# EAGLE design LEMSv2 (EAGLE 7.6.0)
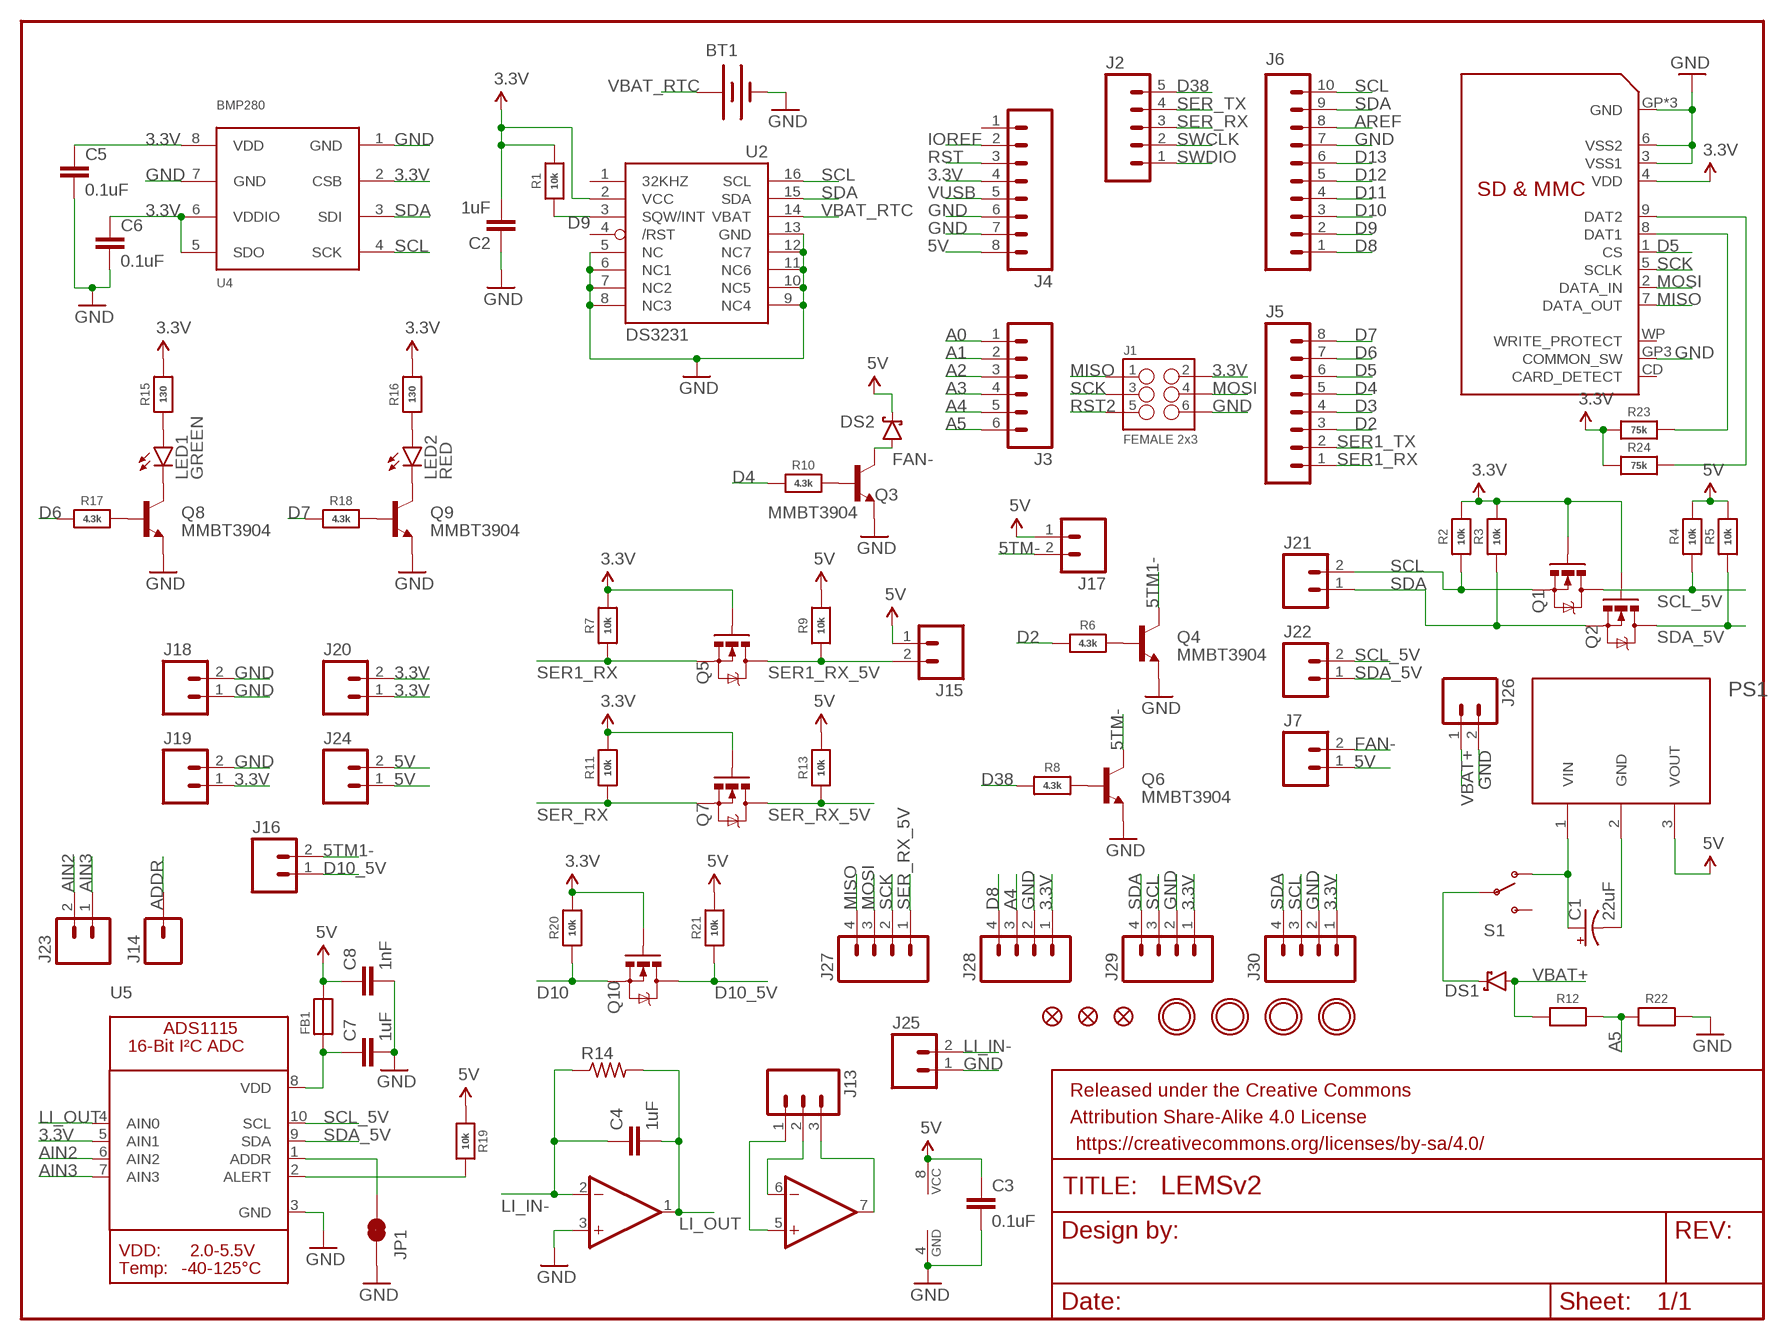
[diagram p0: schematic, sheet 1]

## Parts
BT1  BATTERY12MM  [BATTCON_12MM]
C1  22uF  CAP_POLPTH2  [CPOL-RADIAL-10UF-25V]
C2  1uF  CAP  [_0805]
C3  0.1uF  CAP  [_0805]
C4  1uF  CAP  [_0805]
C5  0.1uF  CAP  [_0805]
C6  0.1uF  CAP  [_0805]
C7  1uF  CAP  [_0805]
C8  1nF  CAP  [_0805]
DS1  DIODE_SCHOTTKY  [DO-214AC]
DS2  DIODE_SCHOTTKY  [DO-214AC]
FB1  FERRITE  [_0805]
FID1  FIDUCIAL""  [FIDUCIAL_1MM]
FID2  FIDUCIAL""  [FIDUCIAL_1MM]
FID3  FIDUCIAL""  [FIDUCIAL_1MM]
FRAME1  FRAME-LETTERNO_PACKAGE  [DUMMY]
J1  FEMALE 2x3  M03X2FEMALE  [2X3]
J2  M05PTH  [1X05]
J3  M06SILK_FEMALE_PTH  [1X06]
J4  M08  [1X08_ROUND]
J5  M08  [1X08_ROUND]
J6  M10SILK_FEMALE_PTH  [1X10]
J7  M023.5MM  [SCREWTERMINAL-3.5MM-2]
J13  M03PTH  [1X03]
J14  M01PTH  [1X01]
J15  M023.5MM  [SCREWTERMINAL-3.5MM-2]
J16  M023.5MM  [SCREWTERMINAL-3.5MM-2]
J17  M023.5MM  [SCREWTERMINAL-3.5MM-2]
J18  M023.5MM  [SCREWTERMINAL-3.5MM-2]
J19  M023.5MM  [SCREWTERMINAL-3.5MM-2]
J20  M023.5MM  [SCREWTERMINAL-3.5MM-2]
J21  M023.5MM  [SCREWTERMINAL-3.5MM-2]
J22  M023.5MM  [SCREWTERMINAL-3.5MM-2]
J23  M023.5MM  [SCREWTERMINAL-3.5MM-2]
J24  M023.5MM  [SCREWTERMINAL-3.5MM-2]
J25  M023.5MM  [SCREWTERMINAL-3.5MM-2]
J26  M023.5MM  [SCREWTERMINAL-3.5MM-2]
J27  M04SCREW  [SCREWTERMINAL-3.5MM-4]
J28  M04SCREW  [SCREWTERMINAL-3.5MM-4]
J29  M04SCREW  [SCREWTERMINAL-3.5MM-4]
J30  M04SCREW  [SCREWTERMINAL-3.5MM-4]
JP1  JUMPER-PAD-2-NC_BY_TRACE  [PAD-JUMPER-2-NC_BY_TRACE_YES_SILK]
LED1  GREEN  LED_GREEN  [LED-0603]
LED2  RED  LED_RED  [LED-0603]
PS1  TSR_1-2450  [TSR_1-2450]
Q1  200mA/50V  MOSFET-NCHANNELBSS138  [SOT23-3]
Q2  200mA/50V  MOSFET-NCHANNELBSS138  [SOT23-3]
Q3  MMBT3904  [SOT23-3]
Q4  MMBT3904  [SOT23-3]
Q5  200mA/50V  MOSFET-NCHANNELBSS138  [SOT23-3]
Q6  MMBT3904  [SOT23-3]
Q7  200mA/50V  MOSFET-NCHANNELBSS138  [SOT23-3]
Q8  MMBT3904  [SOT23-3]
Q9  MMBT3904  [SOT23-3]
Q10  200mA/50V  MOSFET-NCHANNELBSS138  [SOT23-3]
R1  10k  RESISTOR_0805  [_0805]
R2  10k  RESISTOR_0805  [_0805]
R3  10k  RESISTOR_0805  [_0805]
R4  10k  RESISTOR_0805  [_0805]
R5  10k  RESISTOR_0805  [_0805]
R6  4.3k  RESISTOR_0805  [_0805]
R7  10k  RESISTOR_0805  [_0805]
R8  4.3k  RESISTOR_0805  [_0805]
R9  10k  RESISTOR_0805  [_0805]
R10  4.3k  RESISTOR_0805  [_0805]
R11  10k  RESISTOR_0805  [_0805]
R12  RESISTOR_0805  [_0805]
R13  10k  RESISTOR_0805  [_0805]
R14  R-US_FLIPFLOP  [0805-THM]
R15  130  RESISTOR_0805  [_0805]
R16  130  RESISTOR_0805  [_0805]
R17  4.3k  RESISTOR_0805  [_0805]
R18  4.3k  RESISTOR_0805  [_0805]
R19  10k  RESISTOR_0805  [_0805]
R20  10k  RESISTOR_0805  [_0805]
R21  10k  RESISTOR_0805  [_0805]
R22  RESISTOR_0805  [_0805]
R23  75k  RESISTOR_0805  [_0805]
R24  75k  RESISTOR_0805  [_0805]
S1  SWITCH-SPDTPTH  [SWITCH-SPDT]
U1  SDMMC06132  [06132]
U2  DS3231/SO  [SO16W]
U3  TLV2372  [SOIC8]
U4  BMP280  [BMP280]
U5  ADC_ADS1115  [MSOP10]
U$1  MOUNTINGHOLE2.5  [MOUNTINGHOLE_2.5_PLATED]
U$2  MOUNTINGHOLE2.5  [MOUNTINGHOLE_2.5_PLATED]
U$3  MOUNTINGHOLE2.5  [MOUNTINGHOLE_2.5_PLATED]
U$4  MOUNTINGHOLE2.5  [MOUNTINGHOLE_2.5_PLATED]

## Nets
3.3V: C2.2 C5.1 C6.1 J1.2 J4.4 J19.1 J20.1 J20.2 J28.1 J29.1 J30.1 Q1.1(G) Q2.1(G) Q5.1(G) Q7.1(G) Q10.1(G) R1.2 R2.2 R3.2 R7.2 R11.2 R15.2 R16.2 R20.2 R23.1 R24.1 U1.4(VDD) U2.2(VCC) U4.2(CSB) U4.5(SDO) U4.6(VDDIO) U4.8(VDD) U5.5(AIN1)
5TM1-: J16.2 Q4.3(C)
5TM-: J17.2 Q6.3(C)
5V: C3.1 C8.1 DS2.C FB1.2 J4.8 J7.1 J15.1 J17.1 J24.1 J24.2 PS1.3(VOUT) R4.2 R5.2 R9.2 R13.2 R19.1 R21.2 U3.8(TLV2372-PWRN:VCC)
A0: J3.1
A1: J3.2
A2: J3.3
A3: J3.4
A4: J3.5 J28.3
A5: J3.6 R12.2 R22.1
ADDR: J14.1 JP1.1 U5.1(ADDR)
AIN2: J23.2 U5.6(AIN2)
AIN3: J23.1 U5.7(AIN3)
ALERT: R19.2 U5.2(ALERT)
AREF: J6.8
D2: J5.3 R6.1
D3: J5.4
D4: J5.5 R10.1
D5: J5.6 U1.1(CS)
D6: J5.7 R17.1
D7: J5.8 R18.1
D8: J6.1 J28.4
D9: J6.2 R1.1 U2.3(SQW/INT)
D10: J6.3 Q10.2(S) R20.1
D10_5V: J16.1 Q10.3(D) R21.1
D11: J6.4
D12: J6.5
D13: J6.6
D38: J2.5 R8.1
FAN-: DS2.A J7.2 Q3.3(C)
GND: BT1.GND(-) C1.2(-) C2.1 C3.2 C5.2 C6.2 C7.2 C8.2 J1.6 J4.6 J4.7 J6.7 J18.1 J18.2 J19.2 J25.1 J26.2 J28.2 J29.2 J30.2 JP1.2 PS1.2(GND) Q3.2(E) Q4.2(E) Q6.2(E) Q8.2(E) Q9.2(E) R22.2 U1.3(VSS1) U1.6(VSS2) U1.GP2(GND) U1.GP3(COMMON_SW) U1.GP4(GND) U1.GP(GND) U2.5(NC) U2.6(NC1) U2.7(NC2) U2.8(NC3) U2.9(NC4) U2.10(NC5) U2.11(NC6) U2.12(NC7) U2.13(GND) U3.3(TLV2372-1:+IN) U3.4(TLV2372-PWRN:GND) U4.1(GND) U4.7(GND) U5.3(GND)
IOREF: J4.2
LI_IN-: C4.1 J25.2 R14.1 U3.2(TLV2372-1:-IN)
LI_OUT: C4.2 R14.2 U3.1(TLV2372-1:OUT) U5.4(AIN0)
MISO: J1.1 J27.4 U1.7(DATA_OUT)
MOSI: J1.4 J27.3 U1.2(DATA_IN)
N$1: C1.1(+) PS1.1(VIN) S1.1(O)
N$2: J13.2 U3.6(TLV2372-2:-IN)
N$3: J13.1 U3.5(TLV2372-2:+IN)
N$4: J13.3 U3.7(TLV2372-2:OUT)
N$5: Q8.1(B) R17.2
N$6: Q9.1(B) R18.2
N$7: LED1.C Q8.3(C)
N$8: LED2.C Q9.3(C)
N$9: LED1.A R15.1
N$10: LED2.A R16.1
N$11: Q4.1(B) R6.2
N$12: Q6.1(B) R8.2
N$13: DS1.C S1.2(P)
N$14: C7.1 FB1.1 U5.8(VDD)
N$15: Q3.1(B) R10.2
N$17: R23.2 U1.8(DAT1)
N$18: R24.2 U1.9(DAT2)
RST: J4.3
RST2: J1.5
SCK: J1.3 J27.2 U1.5(SCLK)
SCL: J6.10 J21.2 J29.3 J30.3 Q1.2(S) R2.1 U2.16(SCL) U4.4(SCK)
SCL_5V: J22.2 Q1.3(D) R4.1 U5.10(SCL)
SDA: J6.9 J21.1 J29.4 J30.4 Q2.2(S) R3.1 U2.15(SDA) U4.3(SDI)
SDA_5V: J22.1 Q2.3(D) R5.1 U5.9(SDA)
SER1_RX: J5.1 Q5.2(S) R7.1
SER1_RX_5V: J15.2 Q5.3(D) R9.1
SER1_TX: J5.2
SER_RX: J2.3 Q7.2(S) R11.1
SER_RX_5V: J27.1 Q7.3(D) R13.1
SER_TX: J2.4
SWCLK: J2.2
SWDIO: J2.1
VBAT+: DS1.A J26.1 R12.1
VBAT_RTC: BT1.PWR@1(+) U2.14(VBAT)
VUSB: J4.5
Unconnected: J4.1 S1.3(S) U1.CD(CARD_DETECT) U1.WP(WRITE_PROTECT) U2.1(32KHZ) U2.4(/RST)

## Library data of the parts
BT1 = LEMSv2:BATTERY: Battery Holders Various common sizes : AA, AAA, 18650 (PRT-12895), 20mm coin cell and 12mm coin cell. 20MM_4LEGS, BATT-10373; PROD_ID: BATT-08044
C1 = LEMSv2:CAP_POL: Capacitor Polarized These are standard SMD and PTH capacitors. Normally 10uF, 47uF, and 100uF in electrolytic and tantalum varieties. Always verify the external diameter of the through hole cap, it varies with capacity, voltage, and manufacturer. The EIA devices should be standard.
C2-C8 = LEMSv2:CAP: Capacitor Standard 0603 ceramic capacitor, and 0.1" leaded capacitor.
DS1 DS2 = LEMSv2:DIODE_SCHOTTKY
FB1 = LEMSv2:FERRITE: 0805 Ferrite Bead
FID1-FID3 = LEMSv2:FIDUCIAL: Fiducial Alignment Points Various fiducial points for machine vision alignment.; BOM: EXCLUDE
FRAME1 = SparkFun-Aesthetics:FRAME-LETTER: Schematic Frame Standard 8.5x11 US Letter frame; DESIGNER: Nobody; VERSION: v01
J1 = LEMSv2:M03X2: 2x3 .1" header. Shrouded, with keying- CONN-10681 SMT- CONN-11415 Pogo pins- HW-11044; PROD_ID: CONN-11566
J2 = SparkFun-Connectors:M05: Header 5 Standard 5-pin 0.1" header. Use with straight break away headers (SKU : PRT-00116), right angle break away headers (PRT-00553), swiss pins (PRT-00743), machine pins (PRT-00117), and female headers (PRT-00115). Molex polarized connector foot print use with SKU : PRT-08230 with associated crimp pins and housings.
J3 = LEMSv2:M06: Header 6 Standard 6-pin 0.1" header. Use with straight break away headers (SKU : PRT-00116), right angle break away headers (PRT-00553), swiss pins (PRT-00743), machine pins (PRT-00117), and female headers (PRT-00115). Molex polarized connector foot print use with SKU : PRT-08094 with associated crimp pins and housings. NOTES ON THE VARIANTS LOCK and LOCK_LONGPADS... This footprint was designed to help hold the alignment of a through-hole component (i.e. 6-pin header) while soldering it into place. You may notice that each hole has been shifted either up or down by 0.005 of an inch from it's more standard position (which is a perfectly straight line). This slight alteration caused the pins (the squares in the middle) to touch the edges of the holes. Because they are alternating, it causes a "brace" to hold the component in place. 0.005 has proven to be the perfect amount of "off-center" position when using our standard breakaway headers. Although looks a little odd when you look at the bare footprint, once you have a header in there, the alteration is very hard to notice. Also,if you push a header all the way into place, it is covered up entirely on the bottom side. This idea of altering the position of holes to aid alignment will be further integrated into the Sparkfun Library for other footprints. It can help hold any component with 3 or more connection pins.; PROD_ID: CONN-08437
J4 J5 = LEMSv2:M08: Header 8 Standard 8-pin 0.1" header. Use with straight break away headers (SKU : PRT-00116), right angle break away headers (PRT-00553), swiss pins (PRT-00743), machine pins (PRT-00117), and female headers (PRT-00115).; PROD_ID: CONN-08437
J6 = LEMSv2:M10: Header 10 Standard 10-pin 0.1" header. Use with straight break away headers (SKU : PRT-00116), right angle break away headers (PRT-00553), swiss pins (PRT-00743), machine pins (PRT-00117), and female headers (PRT-00115).; PROD_ID: CONN-11563
J7 J15-J26 = LEMSv2:M02: Standard 2-pin 0.1" header. Use with - straight break away headers ( PRT-00116) - right angle break away headers (PRT-00553) - swiss pins (PRT-00743) - machine pins (PRT-00117) - female headers (PRT-00115) Molex polarized connector foot print use with: PRT-08233 with associated crimp pins and housings. 2.54_SCREWTERM for use with PRT-10571. 3.5mm Screw Terminal footprints for PRT-08084 5mm Screw Terminal footprints for use with PRT-08432; PROD_ID: CONN-08399
J13 = LEMSv2:M03: Header 3 Standard 3-pin 0.1" header. Use with straight break away headers (SKU : PRT-00116), right angle break away headers (PRT-00553), swiss pins (PRT-00743), machine pins (PRT-00117), and female headers (PRT-00115). Molex polarized connector foot print use with SKU : PRT-08232 with associated crimp pins and housings.
J14 = SparkFun-Connectors:M01: Header 1 Standard 1-pin 0.1" header. Use with straight break away headers (SKU : PRT-00116), right angle break away headers (PRT-00553), swiss pins (PRT-00743), machine pins (PRT-00117), and female headers (PRT-00115). SMTSO-256-ET is a "flush mount" nut for a 4-40 screw. The older package used to be too tight, and did not allow it to sit properly thru the drill hit. The latest (0.165DIA) fits nice and snug.
J27-J30 = LEMSv2:M04: Header 4 Standard 4-pin 0.1" header. Use with straight break away headers (SKU : PRT-00116), right angle break away headers (PRT-00553), swiss pins (PRT-00743), machine pins (PRT-00117), and female headers (PRT-00115). Molex polarized connector foot print use with SKU : PRT-08231 with associated crimp pins and housings. 1MM SMD Version SKU: PRT-10208; PROD_ID: Combine 2x8399
JP1 = SparkFun-Passives:JUMPER-PAD-2-NC_BY_TRACE
LED1 = LEMSv2:LED_GREEN: Green 0603 LED - Lite-On LTST-C190GKT - https://octopart.com/ltst-c190gkt-lite-on-549821
LED2 = LEMSv2:LED_RED: Green 0603 LED - Lite-On LTST-C190KRKT - https://octopart.com/ltst-c190krkt-lite-on-549893
PS1 = LEMSv2:TSR_1-2450: Traco TSR 1-2450 - DC/DC Step-Down Converter 6.5 - 36VDC input with input capacitor 6.5 - 32VDC input w/out input capacitor 5VDC output
Q1 Q2 = SparkFun-DiscreteSemi:MOSFET-NCHANNEL: Common NMOSFET Parts MFG P/N Store ID Prod ID FDD8780 TRANS-09984 SI7820DN TRANS-11055 FDS6630A IC-08089 2N7002PW TRANS-11151 FQP30N06L COM-10213 TRANS-10060 BSS123LT1G TRANS-08345 BSS138 TRANS-00830 BS170 2N7000; PROD_ID: TRANS-00830
Q3 Q4 Q6 Q8 Q9 = LEMSv2:MMBT3904
Q5 Q7 Q10 = LEMSv2:MOSFET-NCHANNEL: Common NMOSFET Parts MFG P/N Store ID Prod ID FDD8780 TRANS-09984 SI7820DN TRANS-11055 FDS6630A IC-08089 2N7002PW TRANS-11151 FQP30N06L COM-10213 TRANS-10060 BSS123LT1G TRANS-08345 BSS138 TRANS-00830 BS170 2N7000; PROD_ID: TRANS-00830
R1-R13 R15-R24 = LEMSv2:RESISTOR: Resistors For new designs, use the packages preceded by an '_' character since they are more reliable: The following footprints should be used on most boards: _0402 - Standard footprint for regular board layouts _0603 - Standard footprint for regular board layouts _0805 - Standard footprint for regular board layouts _1206 - Standard footprint for regular board layouts For extremely tight-pitch boards where space is at a premium, the following 'micro-pitch' footprints can be used (smaller pads, no silkscreen outline, etc.): _0402MP - Micro-pitch footprint for very dense/compact boards _0603MP - Micro-pitch footprint for very dense/compact boards _0805MP - Micro-pitch footprint for very dense/compact boards _1206MP - Micro-pitch footprint for very dense/compact boards
R14 = adafruit:R-US_: RESISTOR, American symbol
S1 = SparkFun-Electromechanical:SWITCH-SPDT: SPDT Switch Simple slide switch, Spark Fun Electronics SKU : COM-00102 DPDT SMT slide switch, AYZ0202, SWCH-08179; PROD_ID: SWCH-08261
U1 = LEMSv2:SDMMC: SD MMC Card holder 4UCON part #06132 - easy to solder
U2 = LEMSv2:DS3231
U3 = LEMSv2:TLV2372: 2-Channel Single-Supply Rail-to-Rail Op-Amp by TI
U4 = LEMSv2:BMP280: BMP280 - Digital Pressure Sensor Technical Specifications: VCC: 1.2-3.6V Operating Temperature: -40°C to 85°C Full Range: 300-11100 hPa
U5 = LEMSv2:ADC_ADS1115: ADS1115 - 16-bit 4-Channel I2C ADC with Internal PGA VDD: 2.0-5.5V Sampling Rate: 8-860ksps Gain Settings: 2/3, 1, 2, 4, 8, 16
U$1-U$4 = LEMSv2:MOUNTINGHOLE: Mounting Hole For #2 screws (0.086"/2.18mm width, 0.094"/2.4mm hole) use 2.5mm; BOM: EXCLUDE

## Board
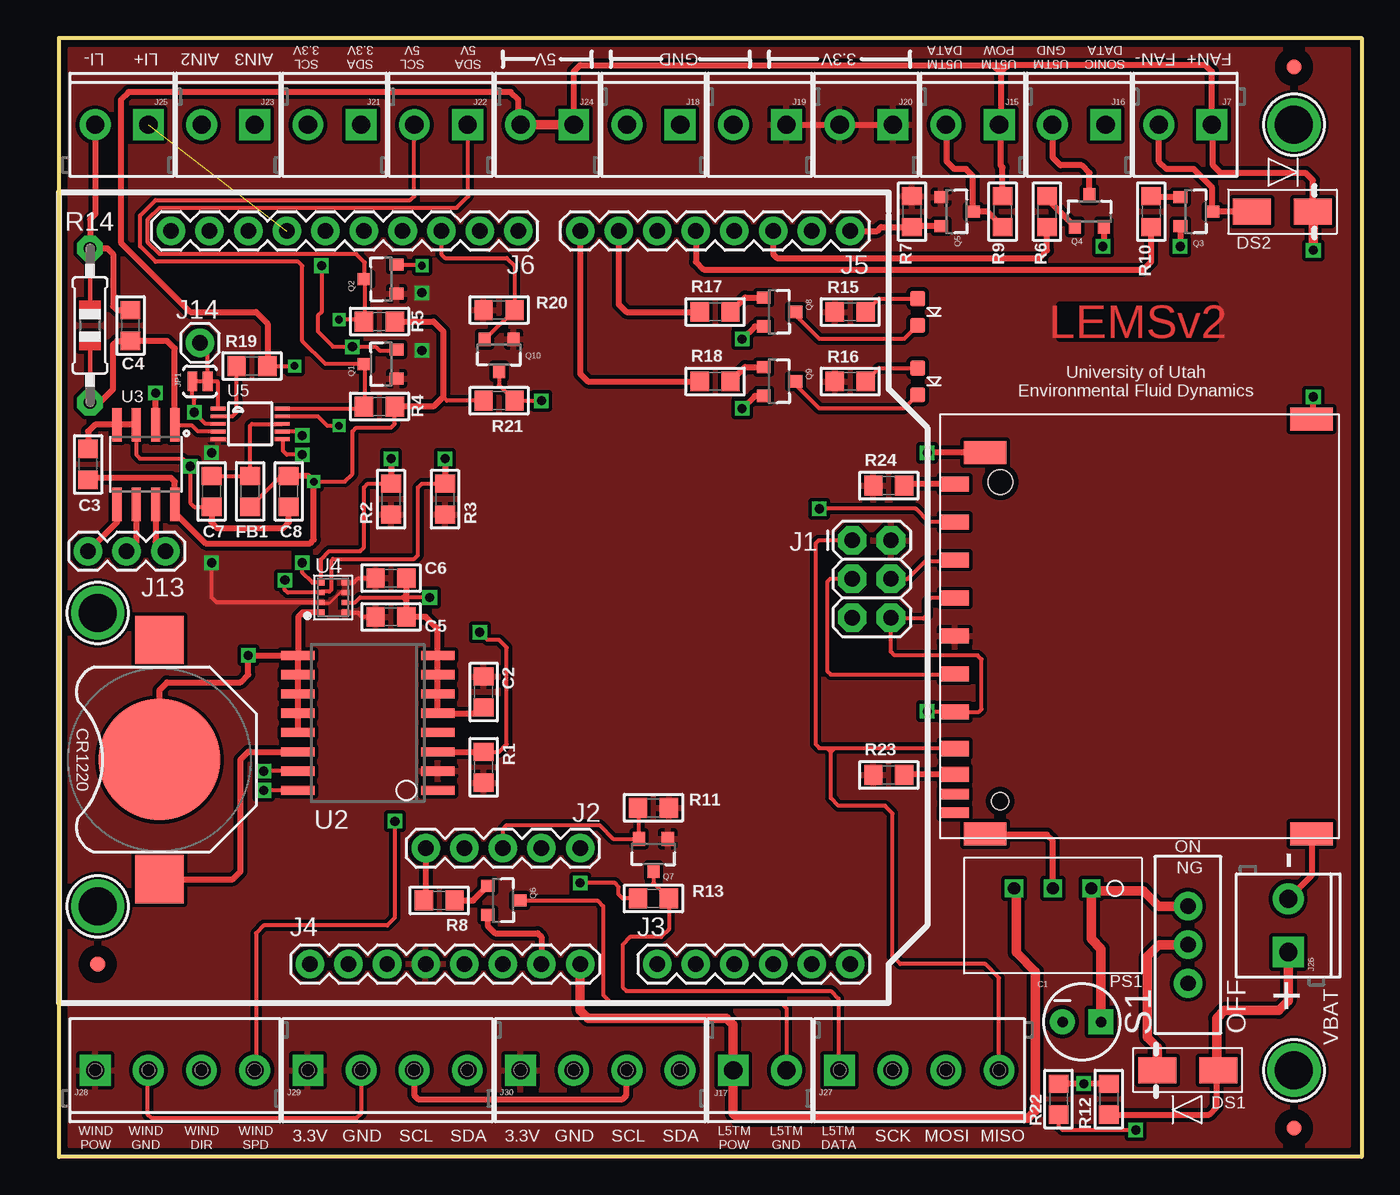
[diagram p1: board, top side]
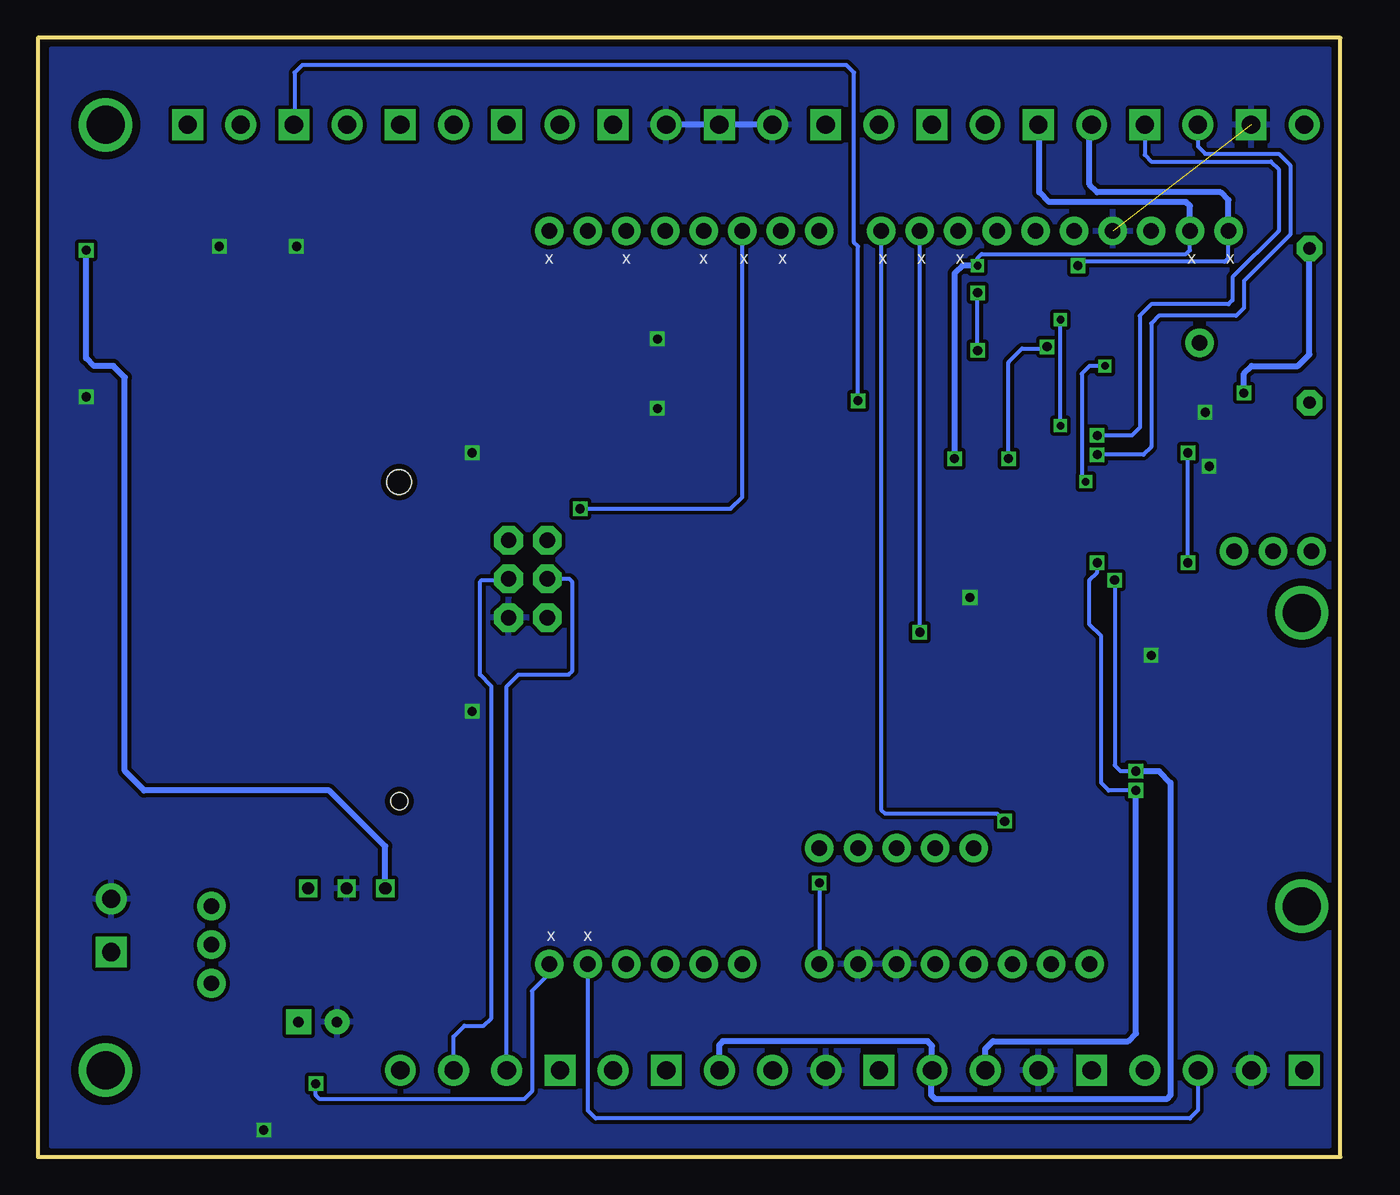
[diagram p2: board, bottom side, seen from below]

Size 85.72 x 73.66 mm. Coordinates in mm from the lower left corner, seen from the top.
Outline: 0,0 0,73.66 85.72,73.66 85.72,0 0,0
Copper layers (1*16): Top 0.0356mm / dielectric 1.5011mm / Bottom 0.0356mm
Design rules "OSHDesignRules": minimum track width 6mil, minimum drill 13mil, track to track 6mil, track to pad 6mil, pad to pad 6mil, via to via 6mil, smd to smd 6mil, copper to edge 15mil, drill to drill 6mil, minimum pad ring 7mil, minimum via ring 7mil, stop-mask expansion 3mil, vias tented up to drill 0mil, thermal gap 10mil

### Footprints (pad centres in the part's own frame; a part is rotated, then mirrored left to right if it is on the bottom)
BATTCON_12MM = smd 8 x 8: GND 0,0 | smd 3.175 x 3.175: PWR@1 -7.874,0; PWR@2 7.874,0
CPOL-RADIAL-10UF-25V = drill 0.7 pad 1.651 square: 1 1.27,0 | drill 0.7 pad 1.651: 2 -1.27,0
_0805 = smd 1.2 x 1.3: 1 -1.016,0; 2 1.016,0
DO-214AC = smd 2.5 x 1.7: A 2,0; C -2,0
FIDUCIAL_1MM = smd 1 x 1: 1 0,0
2X3 = drill 1.016 pad 1.88 octagon: 1 0,0; 2 0,2.54; 3 2.54,0; 4 2.54,2.54; 5 5.08,0; 6 5.08,2.54
1X05 = drill 1.016 pad 1.88: 1 0,0; 2 2.54,0; 3 5.08,0; 4 7.62,0; 5 10.16,0
1X06 = drill 1.016 pad 1.88: 1 0,0; 2 2.54,0; 3 5.08,0; 4 7.62,0; 5 10.16,0; 6 12.7,0
1X08_ROUND = drill 1.016 pad 1.88: 1 0,0; 2 2.54,0; 3 5.08,0; 4 7.62,0; 5 10.16,0; 6 12.7,0; 7 15.24,0; 8 17.78,0
1X10 = drill 1.016 pad 1.88: 1 0,0; 2 2.54,0; 3 5.08,0; 4 7.62,0; 5 10.16,0; 6 12.7,0; 7 15.24,0; 8 17.78,0; 9 20.32,0; 10 22.86,0
SCREWTERMINAL-3.5MM-2 = drill 1.2 pad 2.032 square: 1 -1.75,0 | drill 1.2 pad 2.032: 2 1.75,0
1X03 = drill 1.016 pad 1.88: 1 0,0; 2 2.54,0; 3 5.08,0
1X01 = drill 1.016 pad 1.88: 1 0,0
SCREWTERMINAL-3.5MM-4 = drill 1.2 pad 2.032 square: 1 -5.25,0 | drill 1.2 pad 2.032: 2 -1.75,0; 3 1.75,0; 4 5.25,0
PAD-JUMPER-2-NC_BY_TRACE_YES_SILK = smd 0.635 x 1.27: 1 -0.508,0; 2 0.508,0
LED-0603 = smd 1 x 1: A 0.877,0; C -0.877,0
TSR_1-2450 = drill 0.8 square: 1 -2.54,-1.8; 2 0,-1.8; 3 2.54,-1.8
SOT23-3 = smd 0.8 x 0.9: 1 -0.95,-1; 2 0.95,-1; 3 0,1.1
0805-THM = drill 0.813 pad 1.676 octagon: 1 -5.08,0; 2 5.08,0
SWITCH-SPDT = drill 1.016 pad 1.88: 1 0,2.54; 2 0,0; 3 0,-2.54
06132 = smd 1 x 1.9: 1 6.875,12.175; 2 4.375,12.175; 3 1.875,12.175; 4 -0.625,12.175; 5 -3.125,12.175; 6 -5.625,12.175; 7 -8.05,12.175; 8 -9.75,12.175; 9 9.375,12.175 | smd 0.7 x 1.9: CD -11.05,12.175; WP -12.25,12.175 | smd 1.5 x 2.8: GP -13.65,-11.325; GP2 13.65,-11.325; GP3 11.45,10.175; GP4 -13.65,10.175 | hole 1.1: -11.5,9.175 | hole 1.6: 9.5,9.175
SO16W = smd 0.6 x 2.2: 1 -4.445,-4.6; 2 -3.175,-4.6; 3 -1.905,-4.6; 4 -0.635,-4.6; 5 0.635,-4.6; 6 1.905,-4.6; 7 3.175,-4.6; 8 4.445,-4.6; 9 4.445,4.6; 10 3.175,4.6; 11 1.905,4.6; 12 0.635,4.6; 13 -0.635,4.6; 14 -1.905,4.6; 15 -3.175,4.6; 16 -4.445,4.6
SOIC8 = smd 0.61 x 2.21: 1 -1.905,-2.616; 2 -0.635,-2.616; 3 0.635,-2.616; 4 1.905,-2.616; 5 1.905,2.616; 6 0.635,2.616; 7 -0.635,2.616; 8 -1.905,2.616
BMP280 = smd 0.5 x 0.35: 1 0.8,0.975; 2 0.8,0.325; 3 0.8,-0.325; 4 0.8,-0.975; 5 -0.8,-0.975; 6 -0.8,-0.325; 7 -0.8,0.325; 8 -0.8,0.975
MSOP10 = smd 0.25 x 1: 1 -1,-2.113; 2 -0.5,-2.113; 3 0,-2.113; 4 0.5,-2.113; 5 1,-2.113; 6 1,2.113; 7 0.5,2.113; 8 0,2.113; 9 -0.5,2.113; 10 -1,2.113
MOUNTINGHOLE_2.5_PLATED = drill 2.5 pad 3.2: P$1 0,0

### Placement (x,y rotation side)
BT1  6.6,26.16 90 top
C1  67.31,8.89 0 top
C2  27.94,30.61 90 top
C3  1.91,45.59 90 top
C4  4.7,54.74 270 top
C5  21.84,35.56 0 top
C6  21.84,38.1 0 top
C7  10.03,43.81 270 top
C8  15.11,43.81 270 top
DS1  74.3,5.71 0 top
DS2  80.52,62.23 180 top
FB1  12.57,43.81 270 top
FID1  81.28,1.91 0 top
FID2  2.54,12.7 0 top
FID3  81.28,71.75 0 top
FRAME1  0,0 0 top
J1  52.21,40.59 270 top
J2  34.29,20.32 180 top
J3  39.37,12.7 0 top
J4  16.51,12.7 0 top
J5  52.07,60.96 180 top
J6  30.23,60.96 180 top
J7  74.13,67.94 180 top
J13  1.91,39.88 0 top
J14  9.27,53.59 0 top
J15  60.13,67.94 180 top
J16  67.13,67.94 180 top
J17  46.12,5.71 0 top
J18  39.13,67.94 180 top
J19  46.13,67.94 180 top
J20  53.13,67.94 180 top
J21  18.13,67.94 180 top
J22  25.13,67.94 180 top
J23  11.13,67.94 180 top
J24  32.13,67.94 180 top
J25  4.13,67.94 180 top
J26  80.9,15.24 90 top
J27  56.62,5.71 0 top
J28  7.62,5.71 0 top
J29  21.62,5.71 0 top
J30  35.62,5.71 0 top
JP1  9.27,51.05 180 top
LED1  56.52,55.63 90 top
LED2  56.52,51.05 90 top
PS1  65.41,15.88 180 top
Q1  21.21,52.2 90 top
Q2  21.21,57.78 90 top
Q3  74.8,62.23 270 top
Q4  67.82,62.23 0 top
Q5  59.05,62.23 270 top
Q6  29.21,16.89 270 top
Q7  39.12,19.94 180 top
Q8  47.37,55.63 270 top
Q9  47.37,51.05 270 top
Q10  28.96,52.83 180 top
R1  27.94,25.65 270 top
R2  21.84,43.31 270 top
R3  25.4,43.31 270 top
R4  21.08,49.4 0 top
R5  21.08,54.99 0 top
R6  65.02,62.23 90 top
R7  56.13,62.23 90 top
R8  25.02,16.89 0 top
R9  62.1,62.23 90 top
R10  71.88,62.23 90 top
R11  39.12,22.99 0 top
R12  56k  [_0805]  69.09,3.81 90 top
R13  39.12,17.02 180 top
R14  2.03,54.74 270 top
R15  52.07,55.63 180 top
R16  52.07,51.05 180 top
R17  43.18,55.63 0 top
R18  43.18,51.05 0 top
R19  12.7,52.07 180 top
R20  28.96,55.75 180 top
R21  28.96,49.78 180 top
R22  16k  [_0805]  65.79,3.81 270 top
R23  54.61,25.15 0 top
R24  54.61,44.2 0 top
S1  74.3,13.97 0 top
U1  71.12,34.92 90 top
U2  20.32,28.57 90 top
U3  5.71,45.59 180 top
U4  18.03,36.83 180 top
U5  12.57,48.26 270 top
U$1  81.28,67.94 0 top
U$2  2.54,16.51 0 top
U$3  81.28,5.71 90 top
U$4  2.54,35.81 0 top

### Tracks (layer width: path | path; a pad name or v marks a point on that pad's centre or on a via)
3.3V  (via drill 0.6)
  Top 0.203: U4.6 18.49,37.16 17.78,36.45 17.29,36.45 U4.2
  Top 0.254: C5.1 19.94,35.56 19.68,35.81 18.88,35.81 U4.8 | U4.5 19.39,37.8 19.68,38.1 C6.1 | U4.2 10.36,36.51 10.03,36.83 v10.03,39.12
  Top 0.406: J19.1 J20.2 J20.1
  Bottom 0.254: v23.88,53.09 v23.88,56.9 | v10.03,39.12 v10.03,46.35
  pour Top (isolate 0.254): 0.76,72.9 84.84,72.9 84.84,0.76 0.76,0.76
5TM1-
  Top 0.406: Q4.3 67.82,64.77 67.31,65.28 65.91,65.28 65.41,65.79 65.41,67.92 J16.2
5TM-
  Top 0.254: Q6.3 35.43,16.89 35.81,16.51 35.81,10.67 36.32,10.16 47.5,10.16 47.88,9.78 47.88,5.72 J17.2
5V  (via drill 0.5, 0.6)
  Top 0.254: 14.61,44.83 FB1.2 | R19.1 v15.49,52.07 | v16.76,44.45 18.8,44.45 19.3,44.96 19.3,47.75 19.56,48.01 21.84,48.01 22.1,48.26 R4.2 | R13.2 37.08,17.02 36.83,17.27 36.83,17.78 36.58,18.03 v34.29,18.03 | R21.2 25.53,49.78 25.27,50.04
  Top 0.406: U3.8 7.62,44.45 7.37,44.7 2.03,44.7 C3.1 | 14.61,44.83 C8.1 16.38,44.83 v16.76,44.45 16.76,40.64 16.51,40.39 9.65,40.39 7.62,42.42 | R5.2 24.64,54.99 25.27,54.36 25.27,50.04 24.64,49.4 R4.2 | J24.2 30.23,67.79 30.23,69.6 29.72,70.1 4.57,70.1 4.06,69.6 4.06,60.2 8.64,55.63 12.95,55.63 13.72,54.86 R19.1 | 62.48,71.88 75.44,71.88 75.88,71.44 J7.1 75.95,67.88 75.95,65.28 76.45,64.77 82.04,64.77 82.52,64.29 DS2.C | 62.48,71.88 62.36,71.75 | 62.36,71.75 61.98,71.37 | 61.98,71.37 61.98,68.04 J15.1 61.98,67.85 61.98,65.28 62.1,65.15 R9.2 | J24.1 33.88,71.47 34.29,71.88 61.47,71.88 | 61.72,71.88 62.23,71.88 | 62.23,71.88 62.36,71.75 | 61.98,71.37 61.47,71.88 | 61.47,71.88 61.72,71.88 | 61.72,71.88 61.98,71.63 | 62.23,71.88 62.48,71.88
  Top 0.61: U3.8 7.62,42.42 | J24.2 J24.1 | PS1.3 62.99,17.55 62.99,13.46 64.26,12.19 64.26,3.05 63.75,2.54 44.7,2.54 44.37,2.87 J17.1 44.37,8.72 43.94,9.14 34.8,9.14 34.29,9.65 J4.8 | v82.55,59.69 82.55,62.2 DS2.C
  Bottom 0.254: v15.49,52.07 16.51,52.07 17.02,51.56 17.02,44.7 v16.76,44.45 | v34.29,18.03 J4.8
  Bottom 0.406: PS1.3 62.87,20.45 66.55,24.13 78.74,24.13 80.01,25.4 80.01,51.31 80.77,52.07 82.04,52.07 82.55,52.58 v82.55,59.69
A4
  Bottom 0.254: J28.3 9.37,3.08 9.91,2.54 49.02,2.54 49.53,3.05 J3.5
A5  (via drill 0.6)
  Top 0.406: R12.2 v67.44,4.83 R22.1
  Bottom 0.254: J3.6 52.07,12.06 53.21,10.92 53.21,4.32 53.72,3.81 67.18,3.81 67.44,4.06 v67.44,4.83
ADDR
  Top 0.254: U5.1 10.46,51.01 10.41,51.05 JP1.1 9.78,53.09 J14.1
AIN2  (via drill 0.6)
  Top 0.254: v16,46.23 14.99,46.23 14.73,46.48 14.73,47.21 U5.6
  Bottom 0.254: J23.2 9.38,66.53 8.89,66.04 4.06,66.04 3.3,65.28 3.3,60.71 6.35,57.66 6.35,55.88 6.86,55.37 11.94,55.37 12.45,54.86 12.45,46.74 12.95,46.23 v16,46.23
AIN3  (via drill 0.6)
  Top 0.254: v16,47.5 15.74,47.76 U5.7
  Bottom 0.254: J23.1 12.88,65.96 12.45,65.53 4.57,65.53 4.06,65.02 4.06,60.96 7.11,57.91 7.11,56.39 7.37,56.13 12.45,56.13 13.21,55.37 13.21,48.01 13.72,47.5 v16,47.5
ALERT
  Top 0.254: U5.2 11.42,48.76 11.68,49.02 R19.2
D2
  Top 0.406: J5.3 46.99,59.44 47.24,59.18 64.52,59.18 65.02,59.69 R6.1
D4
  Top 0.406: J5.5 41.91,58.93 42.42,58.42 71.37,58.42 71.88,58.93 R10.1
D5  (via drill 0.6)
  Top 0.254: U1.1 57.26,41.8 56.39,42.67 v50.04,42.67
  Bottom 0.254: v50.04,42.67 40.13,42.67 39.37,43.43 J5.6
D6
  Top 0.406: J5.7 36.83,56.13 37.34,55.63 R17.1
D7
  Top 0.406: J5.8 34.29,51.56 34.8,51.05 R18.1
D8  (via drill 0.6)
  Top 0.254: v22.1,22.1 22.1,15.75 21.59,15.24 13.46,15.24 12.95,14.73 12.95,5.8 J28.4
  Bottom 0.254: J6.1 30.23,22.86 29.97,22.61 22.61,22.61 v22.1,22.1
D9  (via drill 0.6)
  Top 0.254: R1.1 28.96,26.67 29.46,27.18 29.46,33.53 28.96,34.04 28.19,34.04 v27.69,34.54
  Top 0.406: U2.3 R1.1
  Bottom 0.254: v27.69,34.54 J6.2
D10
  Top 0.254: J6.3 25.15,59.44 25.4,59.18 29.46,59.18 29.97,58.67 R20.1 28.05,53.83 Q10.2
D10_5V  (via drill 0.6)
  Top 0.254: Q10.3 28.96,50.8 R21.1 v31.75,49.78
  Bottom 0.254: v31.75,49.78 31.75,59.94 32,60.2 32,71.37 32.51,71.88 68.33,71.88 68.83,71.37 68.83,67.99 J16.1
D38
  Top 0.406: J2.5 24.13,17.02 R8.1
FAN-
  Top 0.406: J7.2 72.39,65.53 72.9,65.02 74.68,65.02 75.9,63.8 Q3.3 DS2.A
GND  (via drill 0.6)  (1 unrouted)
  Top 0.254: U5.3 9.65,48.26 v8.89,49.02 8.89,49.91 8.76,50.04 JP1.2 | U3.3 5.08,46.23 5.33,45.97 8.13,45.97 v8.64,45.47 8.64,43.05 8.89,42.8 C7.2 | U4.7 19.49,36.51 19.81,36.83 22.61,36.83 | 22.61,36.83 22.86,36.58 | v24.38,36.83 22.86,36.83 | J29.2 19.87,2.85 19.56,2.54 6.1,2.54 5.84,2.79 5.84,5.69 J28.2 | R22.2 65.79,2.03 66.04,1.78 v70.87,1.78 | U1.3 57.37,36.8 57.15,36.58 57.15,35.69 56.9,35.43 54.83,35.43 J1.6 54.74,35.5 54.74,33.27 54.99,33.02 60.45,33.02 60.71,32.77 60.71,29.46 60.54,29.3 U1.6 57.19,29.3 v57.15,29.34 | 22.86,37.08 22.61,36.83
  Top 0.406: U2.13 U2.12 U2.11 U2.10 U2.9 | C6.2 22.86,37.08 22.86,36.83 22.86,36.58 C5.2 24.13,35.56 24.92,34.77 U2.8 U2.7 U2.6 U2.5 27.94,29.21 | U4.1 16.04,35.85 15.75,35.56 15.75,33.05 U2.9 | U3.3 U3.4 2.36,48.21 1.91,47.75 C3.2 | C7.2 10.03,41.78 10.41,41.4 14.73,41.4 15.11,41.78 C8.2 | U2.9 v12.45,33.02 12.45,31.75 11.94,31.24 7.11,31.24 6.6,30.73 BT1.GND | 28.19,29.21 27.94,29.21 | 27.94,29.21 C2.1 | U1.GP 82.44,18.54 J26.2 | PS1.2 65.41,20.83 65.02,21.21 61.01,21.21 U1.GP4 | Q6.2 28.21,15.22 28.7,14.73 31.5,14.73 31.75,14.48 J4.7 | U1.GP2 82.55,48.58 v82.55,50.04 | U1.GP3 57.15,46.38 v57.15,46.35 | Q4.2 68.77,60.01 v68.71,59.94 | Q3.2 73.8,59.96 v73.79,59.94 | Q8.2 45.79,54.68 v44.96,53.85 | Q9.2 45.79,50.1 v44.96,49.28
  Bottom 0.406: J18.2 J18.1 J19.2
  pour Bottom (isolate 0.254): 0.76,72.9 84.84,72.9 84.84,0.76 0.76,0.76
LI_IN-  (via drill 0.6)
  Top 0.406: J25.2 2.38,62.07 2.03,61.72 R14.1 3.17,59.82 3.56,59.44 3.56,56.01 3.81,55.75 C4.1 | U3.2 v6.35,50.29
  Bottom 0.406: v6.35,50.29 6.35,51.56 5.84,52.07 2.79,52.07 2.03,52.83 R14.1
LI_OUT
  Top 0.254: U5.4 9.14,47.76 8.76,48.13 7.7,48.13 U3.1
  Top 0.406: R14.2 2.67,49.66 3.56,50.55 3.56,53.47 3.81,53.72 C4.2 7.11,53.72 7.62,53.21 U3.1
MISO
  Top 0.254: J1.1 49.99,40.59 49.78,40.39 49.78,27.18 50.04,26.92 50.55,26.92 | 50.55,26.92 50.8,26.92 | 50.8,26.92 51.05,26.92 | 51.05,26.92 58.9,26.92 U1.7 | J27.4 61.87,11.79 60.96,12.7 55.37,12.7 54.86,13.21 54.86,22.61 54.36,23.11 51.31,23.11 50.8,23.62 50.8,26.67 | 50.8,26.67 50.8,26.92 | 50.55,26.92 50.8,26.67 | 50.8,26.67 51.05,26.92
MOSI
  Top 0.254: J1.4 55.83,38.05 57.02,39.24 58.89,39.24 U1.2
  Bottom 0.254: J27.3 58.37,7.92 57.66,8.64 56.39,8.64 55.88,9.14 55.88,30.99 56.64,31.75 56.64,37.85 56.52,37.97 54.83,37.97 J1.4
N$1
  Top 0.61: S1.1 72.39,16.51 71.37,17.53 68.09,17.53 PS1.1 67.94,14.35 68.58,13.72 C1.1
N$2
  Top 0.406: U3.6 5.08,40.51 J13.2
N$3
  Top 0.406: U3.5 3.81,41.78 J13.1
N$4
  Top 0.406: U3.7 6.35,40.51 J13.3
N$5
  Top 0.406: R17.2 45.15,56.58 Q8.1
N$6
  Top 0.406: R18.2 45.15,52 Q9.1
N$7
  Top 0.254: LED1.C 55.61,53.85 50.04,53.85 48.47,55.41 Q8.3
N$8
  Top 0.254: LED2.C 55.61,49.28 50.04,49.28 48.47,50.84 Q9.3
N$9
  Top 0.254: R15.1 53.96,56.5 LED1.A
N$10
  Top 0.254: R16.1 53.96,51.93 LED2.A
N$11
  Top 0.406: R6.2 65.02,63.07 Q4.1
N$12
  Top 0.406: R8.2 27.26,16.89 Q6.1
N$13
  Top 0.61: DS1.C 72.3,7.21 71.63,7.87 71.63,13.21 72.39,13.97 S1.2
N$14
  Top 0.254: U5.8 12.7,48.26 12.57,48.13 FB1.1 C7.1
N$15
  Top 0.406: Q3.1 71.95,63.18 R10.2
N$17
  Top 0.406: U1.8 55.63,25.18 R23.2
N$18
  Top 0.406: U1.9 55.63,44.3 R24.2
SCK
  Top 0.254: J1.3 50.75,38.05 50.55,37.85 50.55,32 50.8,31.75 58.9,31.75 U1.5
  Bottom 0.254: J27.2 54.87,30.98 54.1,31.75 50.8,31.75 50.55,32 50.55,37.85 50.75,38.05 J1.3
SCL  (via drill 0.6)
  Top 0.254: R2.1 20.32,44.32 20.07,44.07 20.07,40.13 19.81,39.88 17.78,39.88 17.23,39.33 U4.4 16.68,37.8 16,38.48 v16,39.12 | 22.27,53.09 Q1.2 22.15,53.09 21.08,53.09 20.83,53.34 v19.3,53.34 18.03,53.34 17.02,54.36 17.02,55.37 17.27,55.63 v17.27,58.67 | U2.16 v13.46,24.13
  Top 0.406: v21.84,45.97 R2.1 | J29.3 23.37,4.06 23.62,3.81 37.08,3.81 37.34,4.06 37.34,5.68 J30.3
  Bottom 0.254: v13.46,24.13 15.24,24.13 15.75,24.64 15.75,34.29 16.51,35.05 16.51,37.97 16,38.48 v16,39.12 | J6.10 7.37,59.18 7.62,58.93 17.02,58.93 v17.27,58.67 | v21.84,45.97 21.84,52.32 20.95,53.21 19.43,53.21 v19.3,53.34
  Bottom 0.406: J6.10 7.37,62.99 7.87,63.5 16,63.5 16.51,64.01 16.51,67.81 J21.2 | J29.3 23.37,7.11 22.86,7.62 13.97,7.62 13.46,8.13 v13.46,24.13
SCL_5V
  Top 0.254: J22.2 23.37,67.94 23.37,63.25 23.11,62.99 6.35,62.99 5.33,61.98 5.33,59.94 6.35,58.93 15.75,58.93 16,58.67 16,53.72 17.53,52.2 Q1.3 20.11,49.45 R4.1 19.92,49.26 U5.10
SDA  (via drill 0.5, 0.6)
  Top 0.254: Q2.2 23.82,58.73 v23.88,58.67 | R3.1 23.88,44.32 23.62,44.07 23.62,39.62 23.37,39.37 18.03,39.37 17.91,39.24 17.91,37.34 17.78,37.21 17.29,37.21 U4.3 15.04,37.16 14.86,37.34 v14.86,37.97 | U2.15 v13.46,25.4
  Top 0.406: v25.4,45.97 R3.1
  Bottom 0.254: v23.88,58.67 23.88,59.18 23.62,59.44 10.16,59.44 9.91,59.69 J6.9 | v14.86,37.97 14.86,25.78 14.48,25.4 v13.46,25.4
  Bottom 0.406: J6.9 9.91,62.61 10.16,62.87 19.18,62.87 19.81,63.5 19.81,67.88 J21.1 | v23.88,58.67 24.89,58.67 25.4,58.17 v25.4,45.97 | J30.4 40.89,5.74 40.89,7.37 40.64,7.62 27.18,7.62 26.87,7.31 J29.4 26.92,5.66 26.92,4.06 26.67,3.81 11.43,3.81 11.18,4.06 11.18,24.64 11.94,25.4 v13.46,25.4
SDA_5V  (via drill 0.5)
  Top 0.254: J22.1 26.92,67.9 26.92,63.25 26.16,62.48 6.6,62.48 5.84,61.72 5.84,60.2 6.6,59.44 19.56,59.44 20.11,58.88 Q2.3 20.11,55.03 R5.1 19.94,55.12 v18.41,55.12 | 18.29,48.01 v18.41,48.13 17.65,48.13 17.03,48.76 U5.9
  Bottom 0.254: v18.41,48.13 v18.41,55.12
SER1_RX
  Top 0.406: Q5.2 56.2,61.28 R7.1 54.1,61.21 53.85,60.96 J5.1
SER1_RX_5V
  Top 0.406: R9.1 61.09,62.23 Q5.3 60.16,64.56 59.69,65.02 58.93,65.02 58.42,65.53 58.42,67.9 J15.2
SER_RX
  Top 0.254: J2.3 29.21,21.59 29.46,21.84 35.56,21.84 36.45,20.95 38.15,20.95 Q7.2 38.17,22.92 R11.1
SER_RX_5V
  Top 0.254: Q7.3 39.12,18.03 R13.1 40.13,14.99 39.62,14.48 37.59,14.48 37.08,13.97 37.08,11.18 37.34,10.92 50.8,10.92 51.31,10.41 51.31,5.78 J27.1
VBAT+
  Top 0.406: R12.1 75.69,2.79 76.2,3.3 76.2,5.62 DS1.A
  Top 0.61: J26.1 80.9,10.29 80.26,9.65 76.71,9.65 76.2,9.14 76.2,5.81 DS1.A
VBAT_RTC
  Top 0.406: BT1.PWR@1 11.43,18.29 11.94,18.8 11.94,26.16 12.45,26.67 U2.14

### Text on the board
Top: LEMSv2
tPlace: LI- | LI+ | AIN2 | AIN3 | SCL / 3.3V | SDA / 3.3V | SCL / 5V | SDA / 5V | 5V | GND | 3.3V | U5TM / DATA | U5TM / POW | U5TM / GND | SONIC / DATA | FAN- | FAN+ | University of Utah / Environmental Fluid Dynamics | CR1220 | ON | NG | - | OFF | + | VBAT | WIND / POW | WIND / GND | WIND / DIR | WIND / SPD | 3.3V | GND | SCL | SDA | 3.3V | GND | SCL | SDA | L5TM / POW | L5TM / GND | L5TM / DATA | SCK | MOSI | MISO
bPlace: x | x | x | x | x | x | x | x | x | x | x | x
tStop: LEMSv2